# Altium schematic sheet QUECTEL.SchDoc
size A4; SheetNumber: 9; SheetTotal: 10
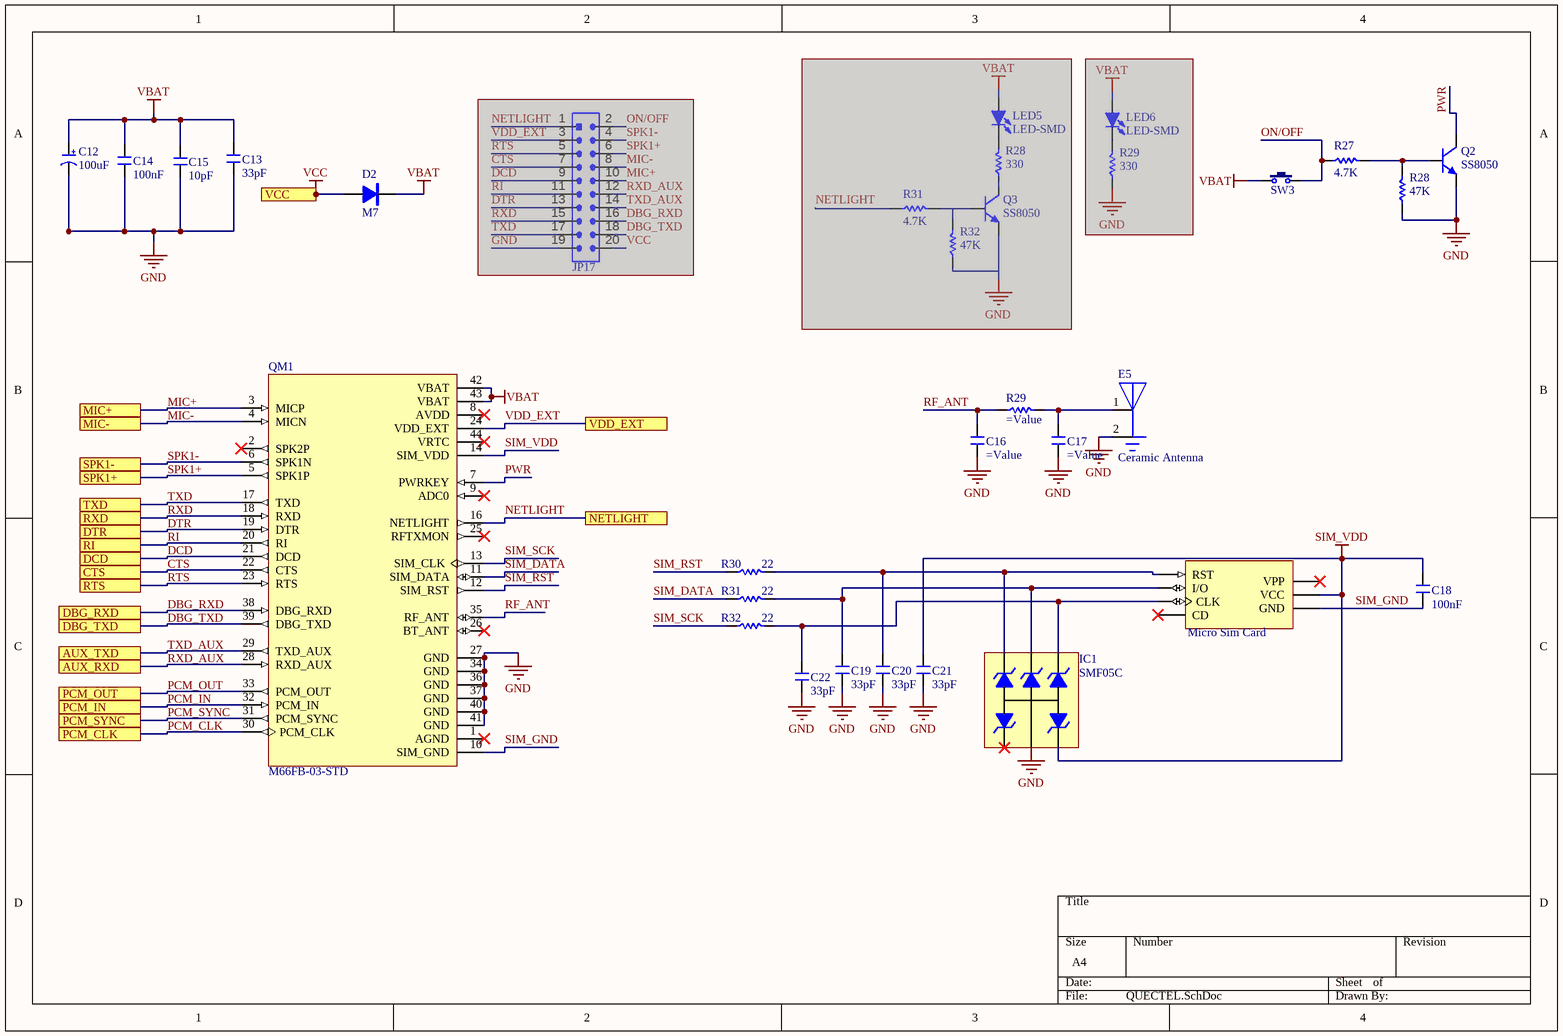
[diagram p0: QUECTEL.SchDoc]

## Parts
(Parts that share a designator on the sheet are numbered #1, #2 ... from top to bottom, then left to right.)
C12  100uF  [CD A(3216)]
C13  33pF  [C 0805]
C14  100nF  [C 0805]
C15  10pF  [C 0805]
C16  (no value)  [C 0805]
C17  (no value)  [C 0805]
C18  100nF  [C 0805]
C19  33pF  [C 0805]
C20  33pF  [C 0805]
C21  33pF  [C 0805]
C22  33pF  [C 0805]
D2  M7  [SMA]
E5  Ceramic Antenna  [Ceramic_915M]
IC1  SMF05C  [SOT23-6L]
JP17  Header 2X10  [HDR-10X2]  (value not drawn)  (masked out: inside a compile mask, not in the netlist)
LED5  LED-SMD  [LED 0805W]  (masked out: inside a compile mask, not in the netlist)
LED6  LED-SMD  [LED 0805W]  (masked out: inside a compile mask, not in the netlist)
Q2  SS8050  [SOT23-3N]
Q3  SS8050  [SOT23-3N]  (masked out: inside a compile mask, not in the netlist)
QM1  M66FB-03-STD  [Quectel M66FB]
R27  4.7K  [R 0805]
R28#1  330  [R 0805]  (masked out: inside a compile mask, not in the netlist)
R28#2  47K  [R 0805]
R29#1  330  [R 0805]  (masked out: inside a compile mask, not in the netlist)
R29#2  (no value)  [R 0805]
R30  22  [R 0805]
R31#1  4.7K  [R 0805]  (masked out: inside a compile mask, not in the netlist)
R31#2  22  [R 0805]
R32#1  47K  [R 0805]  (masked out: inside a compile mask, not in the netlist)
R32#2  22  [R 0805]
Sim_Holder1  Micro Sim Card  [Micro Sim Card]
SW3  3x6x5  [TSW DIP-3*6*5]  (value not drawn)

## Ports
AUX_RXD, AUX_TXD, CTS, DBG_RXD, DBG_TXD, DCD, DTR, MIC+, MIC-, NETLIGHT, PCM_CLK, PCM_IN, PCM_OUT, PCM_SYNC, RI, RTS, RXD, SPK1+, SPK1-, TXD, VCC, VDD_EXT

## Nets
GND: C12.2(K) C13.1 C14.1 C15.1 C16.1 C17.1 C19.1 C20.1 C21.1 C22.1 E5.2 IC1.2(A) Q2.2(E) QM1.27(GND) QM1.34(GND) QM1.36(GND) QM1.37(GND) QM1.40(GND) QM1.41(GND) R28#2.1
SIM_VDD: C18.2 C21.2 IC1.3(K) QM1.14(SIM_VDD) Sim_Holder1.C1(VCC)
VBAT: C12.1(A) C13.2 C14.2 C15.2 D2.2(K) QM1.42(VBAT) QM1.43(VBAT) SW3.1
VCC: D2.1(A) ; port VCC
CTS: QM1.22(CTS) ; port CTS
DBG_RXD: QM1.38(DBG_RXD) ; port DBG_RXD
DBG_TXD: QM1.39(DBG_TXD) ; port DBG_TXD
DCD: QM1.21(DCD) ; port DCD
DTR: QM1.19(DTR) ; port DTR
MIC+: QM1.3(MICP) ; port MIC+
MIC-: QM1.4(MICN) ; port MIC-
NETLIGHT: QM1.16(NETLIGHT) ; port NETLIGHT
ON/OFF: R27.1 SW3.2
PCM_CLK: QM1.30(PCM_CLK) ; port PCM_CLK
PCM_IN: QM1.32(PCM_IN) ; port PCM_IN
PCM_OUT: QM1.33(PCM_OUT) ; port PCM_OUT
PCM_SYNC: QM1.31(PCM_SYNC) ; port PCM_SYNC
PWR: Q2.3(C) QM1.7(PWRKEY)
RF_ANT: C16.2 QM1.35(RF_ANT) R29#2.1
RI: QM1.20(RI) ; port RI
RTS: QM1.23(RTS) ; port RTS
RXD: QM1.18(RXD) ; port RXD
RXD_AUX: QM1.28(RXD_AUX) ; port AUX_RXD
SIM_DATA: QM1.11(SIM_DATA) R31#2.1
SIM_GND: C18.1 QM1.10(SIM_GND) Sim_Holder1.C5(GND)
SIM_RST: QM1.12(SIM_RST) R30.1
SIM_SCK: QM1.13(SIM_CLK) R32#2.1
SPK1+: QM1.5(SPK1P) ; port SPK1+
SPK1-: QM1.6(SPK1N) ; port SPK1-
TXD: QM1.17(TXD) ; port TXD
TXD_AUX: QM1.29(TXD_AUX) ; port AUX_TXD
VDD_EXT: QM1.24(VDD_EXT) ; port VDD_EXT
NetC17_2: C17.2 E5.1 R29#2.2
NetC19_2: C19.2 IC1.5(K) R31#2.2 Sim_Holder1.C7(I/O)
NetC20_2: C20.2 IC1.4(K) R30.2 Sim_Holder1.C2(RST)
NetC22_2: C22.2 IC1.6(K) R32#2.2 Sim_Holder1.C3(CLK)
NetQ2_1: Q2.1(B) R27.2 R28#2.2

Not connected (* = marked no-connect by the designer): IC1 1(K)*; QM1 1(AGND)* 2(SPK2P)* 8(AVDD)* 9(ADC0)* 25(RFTXMON)* 26(BT_ANT)* 44(VRTC)*; Sim_Holder1 C6(VPP)* CD*

## Notes on the sheet
- (in symbol C-CD) +

## Library data of the parts
C12 = C-CD: Solid Tantalum Chip Capacitor, Standard T491 Series - Industrial Grade; Published: 17-Jul-2002; LatestRevisionDate: 19-Mar-2004; LatestRevisionNote: Silkscreen dimensions re-sized.; DatasheetDocument: Mar-2001; PackageDocument: Mar-2001; PackageReference: B; Publisher: Altium Limited; Code_JEITA: 3528-21; ComponentLink1Description: Manufacturer Link; ComponentLink1URL: http://www.kemet.com/; ComponentLink2Description: Datasheet; ComponentLink2URL: http://www.kemet.com/kemet/web/homepage/kechome.nsf/vapubfilesname/F3102TA.pdf/$file/F3102TA.pdf
C13-C22 = C: Non-polar patch capacitor; BOM名称: 无极性贴片电容; 版权归属: 源创客; 学习资源: www.ooocke.com
D2 = M7: Rectifier diode; BOM名称: 整流二极管; 版权归属: 源创客; 学习资源: www.ooocke.com
IC1 = SMF05C: ESD Protection Diode Array, 5-Line
JP17 = Header 10X2: 10*2P Connector; BOM名称: 10*2P接插件; 版权归属: 源创客; 学习资源: www.ooocke.com
LED5 LED6 = LED-SMD: Patch LED; BOM名称: 贴片LED; 版权归属: 源创客; 学习资源: www.ooocke.com
Q2 Q3 = 8050-SMD: High frequency amplification-NPN; BOM名称: 高频放大-NPN型; 版权归属: 源创客; 属性: 40V 1.5A 1W 100MHZ; 学习资源: www.ooocke.com
QM1 = Quectel M66: Package: None; MP: M66FB-03-STD; MF: Quectel; Availability: Unavailable; Price: None; SnapEDA_Link: https://www.snapeda.com/parts/M66FB-03-STD/Quectel/view-part/?ref=snap; Value: *
R27 R28#1 R28#2 R29#1 R29#2 R30 R31#1 R31#2 R32#1 R32#2 = R: Chip resistor; 版权归属: 源创客; BOM名称: Chip resistor; 学习资源: www.ooocke.com
Sim_Holder1 = Micro Sim Card: SIMCARD 6PIN
SW3 = TSW 3x6: 3x6 tact switch; BOM名称: 3x6轻触开关; 版权归属: 源创客; 学习资源: www.ooocke.com